# Altium schematic sheet can-SN65HVD233.SchDoc: SN65HVD233
size A4; DrawnBy: Dylan Vogel; Organization: UTAT SS; Revision: 1.0
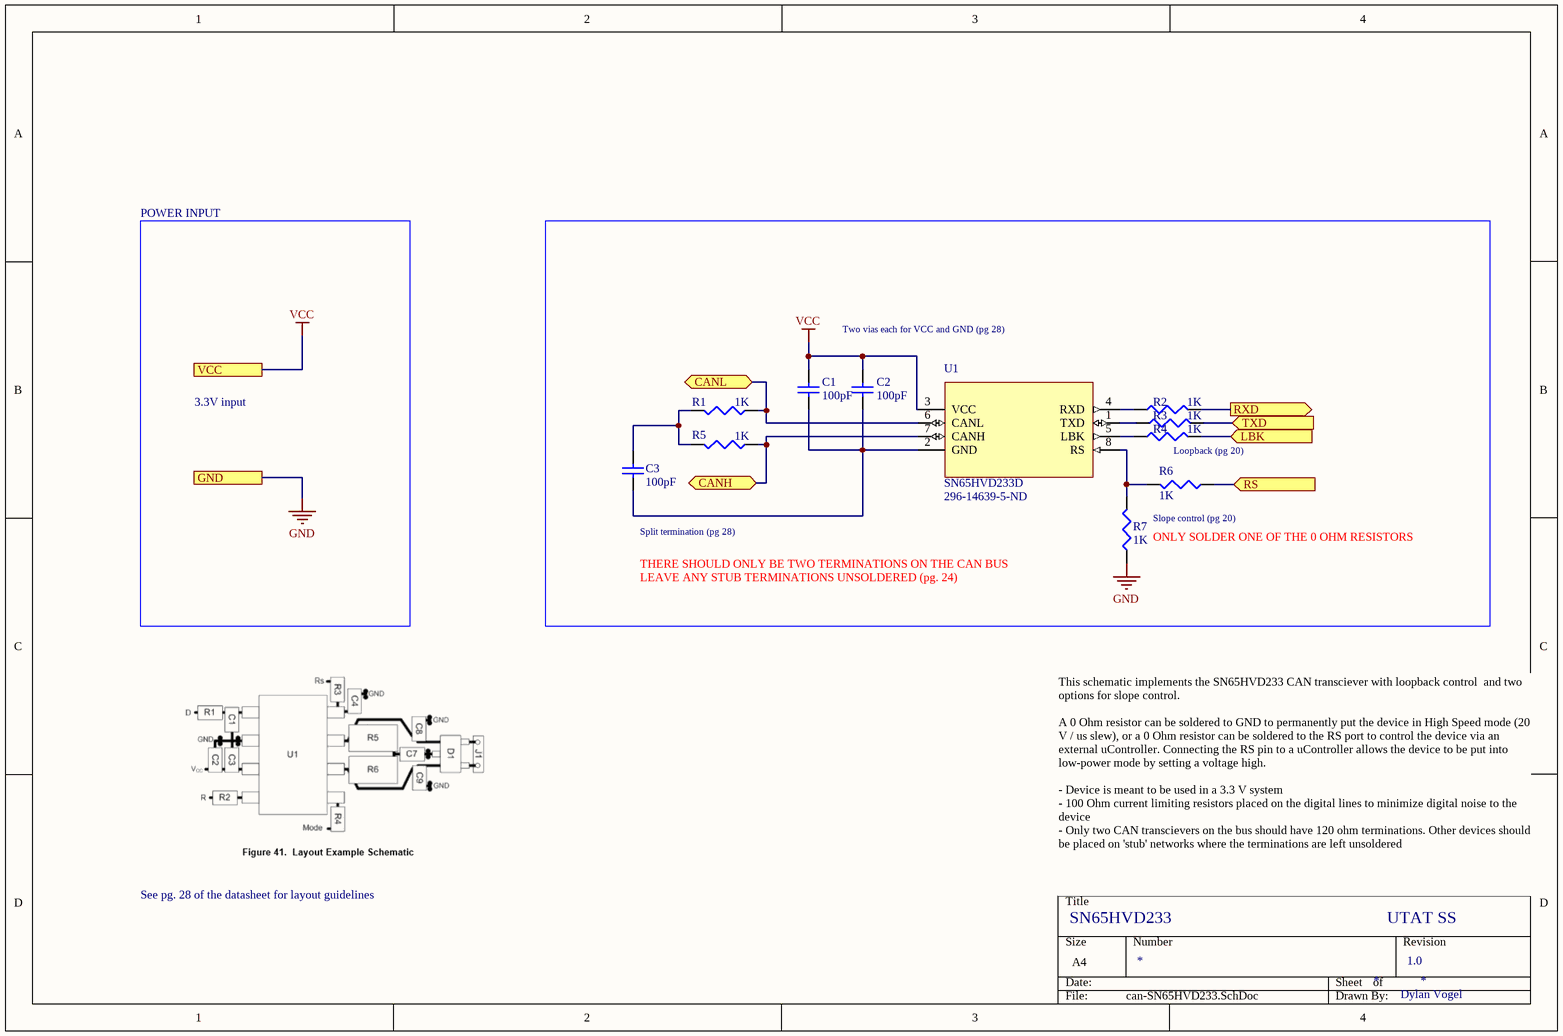
[diagram p0: can-SN65HVD233.SchDoc]

## Parts
C1  value 100pF  [C1206]  (hidden comment: Cap Semi)
C2  value 100pF  [C1206]  (hidden comment: Cap Semi)
C3  value 100pF  [C1206]  (hidden comment: Cap Semi)
R1  value 1K  [J1-0603]  (hidden comment: Res3)
R2  value 1K  [J1-0603]  (hidden comment: Res3)
R3  value 1K  [J1-0603]  (hidden comment: Res3)
R4  value 1K  [J1-0603]  (hidden comment: Res3)
R5  value 1K  [J1-0603]  (hidden comment: Res3)
R6  value 1K  [J1-0603]  (hidden comment: Res3)
R7  value 1K  [J1-0603]  (hidden comment: Res3)
U1  SN65HVD233D  Supplier Part Number 1: 296-14639-5-ND  [SOIC127P500X600-8N]

## Ports
CANH (bidir), CANL (bidir), GND, LBK (in), RS (in), RXD (out), TXD (in), VCC

## Nets
GND: R7.1 ; port GND
VCC: C1.1 C2.1 U1.3(VCC) ; port VCC
CANH: R5.1 U1.7(CANH) ; port CANH
CANL: R1.1 U1.6(CANL) ; port CANL
LBK: R4.2 ; port LBK
RS: R6.1 ; port RS
RXD: R2.2 ; port RXD
TXD: R3.2 ; port TXD
NetC1_2: C1.2 C2.2 C3.1 U1.2(GND)
NetC3_2: C3.2 R1.2 R5.2
NetR2_1: R2.1 U1.4(RXD)
NetR3_1: R3.1 U1.1(TXD)
NetR4_1: R4.1 U1.5(LBK)
NetR6_2: R6.2 R7.2 U1.8(RS)

## Notes on the sheet
- POWER INPUT
- Two vias each for VCC and GND (pg 28)
- 3.3V input
- Slope control (pg 20)
- (near R4) Loopback (pg 20)
- (near C3) Split termination (pg 28)
- THERE SHOULD ONLY BE TWO TERMINATIONS ON THE CAN BUS
- LEAVE ANY STUB TERMINATIONS UNSOLDERED (pg. 24)
- (near R7) ONLY SOLDER ONE OF THE 0 OHM RESISTORS
- See pg. 28 of the datasheet for layout guidelines
- This schematic implements the SN65HVD233 CAN transciever with loopback control  and two options for slope control.
  A 0 Ohm resistor can be soldered to GND to permanently put the device in High Speed mode (20 V / us slew), or a 0 Ohm resistor can be soldered to the RS port to control the device via an external uController. Connecting the RS pin to a uController allows the device to be put into low-power mode by setting a voltage high.
  - Device is meant to be used in a 3.3 V system
  - 100 Ohm current limiting resistors placed on the digital lines to minimize digital noise to the device
  - Only two CAN transcievers on the bus should have 120 ohm terminations. Other devices should be placed on 'stub' networks where the terminations are left unsoldered

## Library data of the parts
C1-C3 = Cap Semi: Capacitor (Semiconductor SIM Model); Published: 8-Jun-2000; LatestRevisionDate: 29-May-2009; LatestRevisionNote: IPC-7351 Footprint Added.; PackageReference: C1206; Publisher: Altium Limited; PackageDescription: Chip Capacitor
R1-R7 = Res3: Resistor; Published: 8-Jun-2000; LatestRevisionDate: 29-May-2009; LatestRevisionNote: IPC-7351 Footprint Added.; PackageReference: J1-0603; Publisher: Altium Limited; PackageDescription: Chip Resistor
U1 = SN65HVD233D: 3.3V CAN Transceiver with Standby Mode, Loop-back 8-SOIC -40 to 125; MF: Texas Instruments; MP: SN65HVD233D; Package: SOIC-8 Texas Instruments; Availability: Good; SnapEDA_Link: https://www.snapeda.com/parts/SN65HVD233D/Texas%20Instruments/view-part/?ref=snap; Price: 2.39 USD; Value: *; Supplier 1: Digi-Key